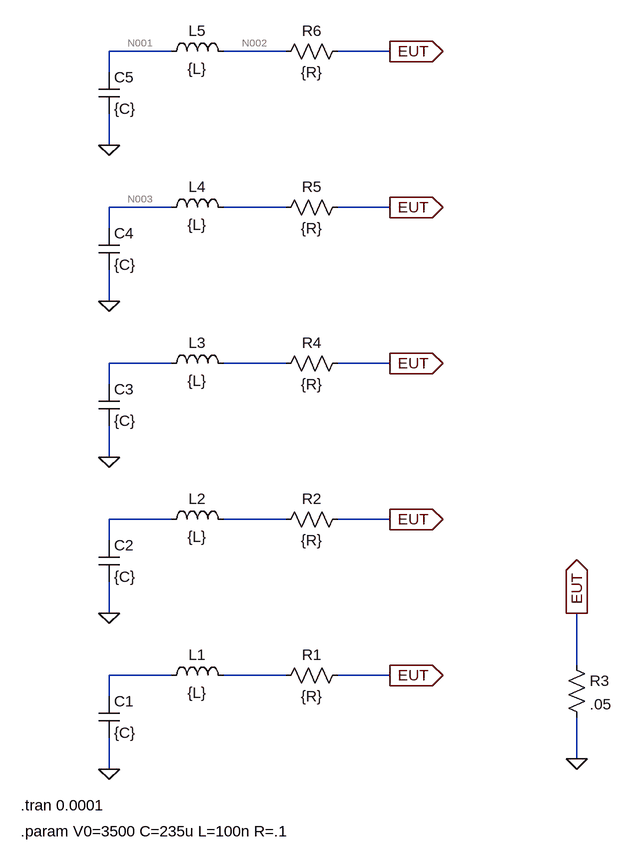
[diagram p0: schematic 8x20 - Five Capacitors.asc]
8x20 - Five Capacitors.asc, the LTspice schematic file:
Version 4
SHEET 1 880 680
WIRE 144 -864 48 -864
WIRE 320 -864 224 -864
WIRE 480 -864 400 -864
WIRE 48 -832 48 -864
WIRE 48 -720 48 -768
WIRE 144 -624 48 -624
WIRE 320 -624 224 -624
WIRE 480 -624 400 -624
WIRE 48 -592 48 -624
WIRE 48 -480 48 -528
WIRE 144 -384 48 -384
WIRE 320 -384 224 -384
WIRE 480 -384 400 -384
WIRE 48 -352 48 -384
WIRE 48 -240 48 -288
WIRE 144 -144 48 -144
WIRE 320 -144 224 -144
WIRE 480 -144 400 -144
WIRE 48 -112 48 -144
WIRE 48 0 48 -48
WIRE 768 80 768 0
WIRE 144 96 48 96
WIRE 320 96 224 96
WIRE 480 96 400 96
WIRE 48 128 48 96
WIRE 768 224 768 160
WIRE 48 240 48 192
FLAG 48 240 0
FLAG 480 96 EUT
IOPIN 480 96 Out
FLAG 768 0 EUT
IOPIN 768 0 Out
FLAG 768 224 0
FLAG 48 0 0
FLAG 480 -144 EUT
IOPIN 480 -144 Out
FLAG 48 -240 0
FLAG 480 -384 EUT
IOPIN 480 -384 Out
FLAG 48 -480 0
FLAG 480 -624 EUT
IOPIN 480 -624 Out
FLAG 48 -720 0
FLAG 480 -864 EUT
IOPIN 480 -864 Out
SYMBOL cap 32 128 R0
SYMATTR InstName C1
SYMATTR Value {C}
SYMATTR SpiceLine IC={V0}
SYMBOL ind 128 112 R270
WINDOW 0 32 56 VTop 2
WINDOW 3 5 56 VBottom 2
SYMATTR InstName L1
SYMATTR Value {L}
SYMBOL res 416 80 R90
WINDOW 0 0 56 VBottom 2
WINDOW 3 32 56 VTop 2
SYMATTR InstName R1
SYMATTR Value {R}
SYMBOL res 752 64 R0
SYMATTR InstName R3
SYMATTR Value .05
SYMBOL cap 32 -112 R0
SYMATTR InstName C2
SYMATTR Value {C}
SYMATTR SpiceLine IC={V0}
SYMBOL ind 128 -128 R270
WINDOW 0 32 56 VTop 2
WINDOW 3 5 56 VBottom 2
SYMATTR InstName L2
SYMATTR Value {L}
SYMBOL res 416 -160 R90
WINDOW 0 0 56 VBottom 2
WINDOW 3 32 56 VTop 2
SYMATTR InstName R2
SYMATTR Value {R}
SYMBOL cap 32 -352 R0
SYMATTR InstName C3
SYMATTR Value {C}
SYMATTR SpiceLine IC={V0}
SYMBOL ind 128 -368 R270
WINDOW 0 32 56 VTop 2
WINDOW 3 5 56 VBottom 2
SYMATTR InstName L3
SYMATTR Value {L}
SYMBOL res 416 -400 R90
WINDOW 0 0 56 VBottom 2
WINDOW 3 32 56 VTop 2
SYMATTR InstName R4
SYMATTR Value {R}
SYMBOL cap 32 -592 R0
SYMATTR InstName C4
SYMATTR Value {C}
SYMATTR SpiceLine IC={V0}
SYMBOL ind 128 -608 R270
WINDOW 0 32 56 VTop 2
WINDOW 3 5 56 VBottom 2
SYMATTR InstName L4
SYMATTR Value {L}
SYMBOL res 416 -640 R90
WINDOW 0 0 56 VBottom 2
WINDOW 3 32 56 VTop 2
SYMATTR InstName R5
SYMATTR Value {R}
SYMBOL cap 32 -832 R0
SYMATTR InstName C5
SYMATTR Value {C}
SYMATTR SpiceLine IC={V0}
SYMBOL ind 128 -848 R270
WINDOW 0 32 56 VTop 2
WINDOW 3 5 56 VBottom 2
SYMATTR InstName L5
SYMATTR Value {L}
SYMBOL res 416 -880 R90
WINDOW 0 0 56 VBottom 2
WINDOW 3 32 56 VTop 2
SYMATTR InstName R6
SYMATTR Value {R}
TEXT -88 296 Left 2 !.tran 0.0001
TEXT -88 336 Left 2 !.param V0=3500 C=235u L=100n R=.1

The netlist it stands for:
* 8x20 - Five Capacitors.asc
C1 N009 0 {C} IC={V0}
L1 N009 N010 {L}
R1 EUT N010 {R}
R3 EUT 0 .05
C2 N007 0 {C} IC={V0}
L2 N007 N008 {L}
R2 EUT N008 {R}
C3 N005 0 {C} IC={V0}
L3 N005 N006 {L}
R4 EUT N006 {R}
C4 N003 0 {C} IC={V0}
L4 N003 N004 {L}
R5 EUT N004 {R}
C5 N001 0 {C} IC={V0}
L5 N001 N002 {L}
R6 EUT N002 {R}
.tran 0.0001
.param V0=3500 C=235u L=100n R=.1
.backanno
.end

* Results of the author's LTspice run, read from the files saved beside the schematic
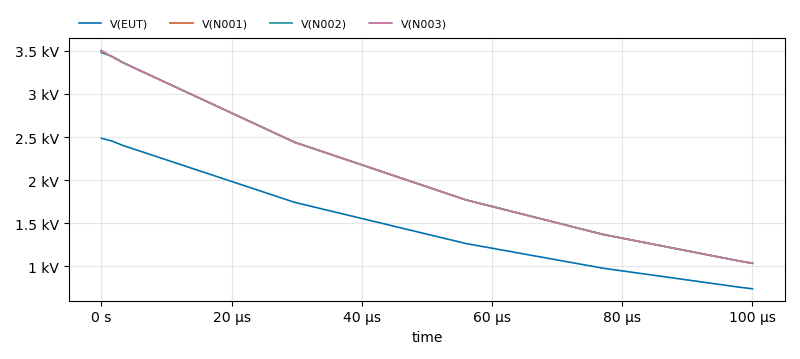
[diagram p1: Transient Analysis of 8x20 - Five Capacitors.asc, plotted from the saved traces]
* Transient Analysis, 1 run:
*   V(EUT): min 741.1 V, max 2.486 kV, average 1.457 kV, rms 1.553 kV, last 741.1 V
*   V(N001): min 1.037 kV, max 3.505 kV, average 2.039 kV, rms 2.174 kV, last 1.037 kV
*   V(N002): min 1.038 kV, max 3.48 kV, average 2.04 kV, rms 2.175 kV, last 1.038 kV
*   V(N003): min 1.037 kV, max 3.505 kV, average 2.039 kV, rms 2.174 kV, last 1.037 kV